# EAGLE schematic v3-landshark-handheld-controller (EAGLE 6.6.0)
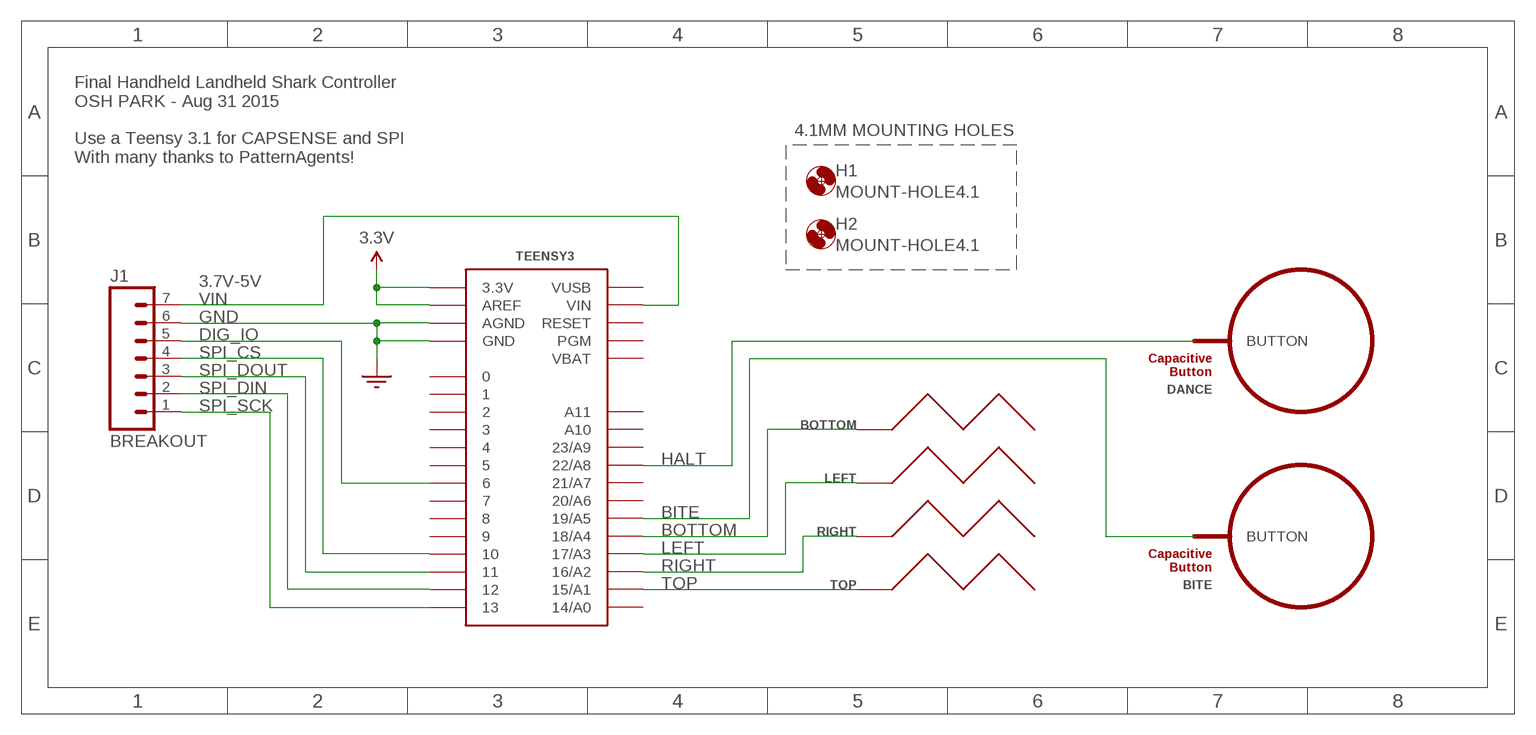
[diagram p0: schematic, sheet 1]

## Parts
BITE  BUTTON_PASSIVE_12MM_BITE  [BUTTON_PASSIVE_12MM_BITE]
BOTTOM  SLIDER_PASSIVE_1SEG  [SLIDER_PASSIVE_1SEG_12MM]
DANCE  BUTTON_PASSIVE_12MM_DANCE  [BUTTON_PASSIVE_12MM_DANCE]
H1  MOUNT-HOLE4.1  [4,1]
H2  MOUNT-HOLE4.1  [4,1]
J1  BREAKOUT  M07LOCK_LONGPADS  [1X07_LOCK_LONGPADS]
LEFT  SLIDER_PASSIVE_1SEG  [SLIDER_PASSIVE_1SEG_12MM]
RIGHT  SLIDER_PASSIVE_1SEG  [SLIDER_PASSIVE_1SEG_12MM]
TEENSY3  TEENSY_3.0+4  [TEENSY_3.0+4]
TOP  SLIDER_PASSIVE_1SEG  [SLIDER_PASSIVE_1SEG_12MM]

## Nets
3.3V: TEENSY3.3.3V TEENSY3.3.3V1(3.3V) TEENSY3.AREF
BITE: BITE.BUTTON TEENSY3.19/A5
BOTTOM: BOTTOM.P$1(SL1) TEENSY3.18/A4
DIG_IO: J1.5 TEENSY3.6
GND: J1.6 TEENSY3.AGND TEENSY3.GND TEENSY3.GND1(GND)
HALT: DANCE.BUTTON TEENSY3.22/A8
LEFT: LEFT.P$1(SL1) TEENSY3.17/A3
RIGHT: RIGHT.P$1(SL1) TEENSY3.16/A2
SPI_CS: J1.4 TEENSY3.10
SPI_DIN: J1.2 TEENSY3.12
SPI_DOUT: J1.3 TEENSY3.11
SPI_SCK: J1.1 TEENSY3.13
TOP: TEENSY3.15/A1 TOP.P$1(SL1)
VIN: J1.7 TEENSY3.VIN
Unconnected: TEENSY3.0 TEENSY3.1 TEENSY3.2 TEENSY3.3 TEENSY3.4 TEENSY3.5 TEENSY3.7 TEENSY3.8 TEENSY3.9 TEENSY3.14/A0 TEENSY3.20/A6 TEENSY3.21/A7 TEENSY3.23/A9 TEENSY3.A10 TEENSY3.A11 TEENSY3.PGM TEENSY3.RESET

## Notes on the sheet
- 4.1MM MOUNTING HOLES
- Final Handheld Landheld Shark Controller
  OSH PARK - Aug 31 2015
  
  Use a Teensy 3.1 for CAPSENSE and SPI
  With many thanks to PatternAgents!
- 3.7V-5V

## Power pins joined to a net without a drawn wire
VBAT: TEENSY3.VBAT
VUSB: TEENSY3.VUSB

## Library data of the parts
BITE = PatternAgents-TouchWidgets:BUTTON_PASSIVE_12MM_BITE
BOTTOM LEFT RIGHT TOP = PatternAgents-TouchWidgets:SLIDER_PASSIVE_1SEG: Slider, Passive Touch/Capacitive Sensing Type, One (1) Segment Source : http://www.PatternAgents.com Github : https://github.com/PatternAgents License : http://creativecommons.org/licenses/by-sa/3.1/ (Creative Commons 3.1) THIS SOFTWARE IS PROVIDED BY THE CONTRIBUTORS "AS IS" AND WITHOUT ANY EXPRESS OR IMPLIED WARRANTIES, INCLUDING, BUT NOT LIMITED TO, THE IMPLIED WARRANTIES OF MERCHANTABILITY AND FITNESS FOR A PARTICULAR PURPOSE ARE DISCLAIMED. IN NO EVENT SHALL THE COPYRIGHT OWNER OR CONTRIBUTORS BE LIABLE FOR ANY DIRECT, INDIRECT, INCIDENTAL, SPECIAL, EXEMPLARY, OR CONSEQUENTIAL DAMAGES (INCLUDING, BUT NOT LIMITED TO, PROCUREMENT OF SUBSTITUTE GOODS OR SERVICES; LOSS OF USE, DATA, OR PROFITS; OR BUSINESS INTERRUPTION) HOWEVER CAUSED AND ON ANY THEORY OF LIABILITY, WHETHER IN CONTRACT, STRICT LIABILITY, OR TORT (INCLUDING NEGLIGENCE OR OTHERWISE) ARISING IN ANY WAY OUT OF THE USE OF THIS SOFTWARE, EVEN IF ADVISED OF THE POSSIBILITY OF SUCH DAMAGE.
DANCE = PatternAgents-TouchWidgets:BUTTON_PASSIVE_12MM_DANCE
H1 H2 = holes:MOUNT-HOLE: MOUNTING HOLE with drill center marker
J1 = SparkFun-Connectors:M07: Header 7 Standard 7-pin 0.1" header. Use with straight break away headers (SKU : PRT-00116), right angle break away headers (PRT-00553), swiss pins (PRT-00743), machine pins (PRT-00117), and female headers (PRT-00115). NOTES ON THE VARIANTS LOCK and LOCK_LONGPADS... This footprint was designed to help hold the alignment of a through-hole component (i.e. 7-pin header) while soldering it into place. You may notice that each hole has been shifted either up or down by 0.005 of an inch from it's more standard position (which is usually a perfectly straight line). This slight alteration caused the pins (the squares in the middle) to touch the edges of the holes. Because they are alternating, it causes a "brace" to hold the header in place. 0.005 has proven to be the perfect amount of "off-center" position when using our standard breakaway headers. Although looks a little odd when you look at the bare footprint, once you have a header in there, the alteration is very hard to notice. Also, if you push a header all the way into place, it is covered up entirely on the bottom side. This idea of altering the position of holes to aid alignment will be further integrated into the Sparkfun Library for other footprints. It can help hold any component with 3 or more connection pins.
TEENSY3 = Teensy3.0:TEENSY_3.0+4: Teensy 3.0 board, showing all pins that are easily acessible. See 'AllAnalogPins" and 'AllPins' packages for additional pin holes, as needed. The 'Basic' package has fewer pins.